# EAGLE schematic project (EAGLE 9.3.0)
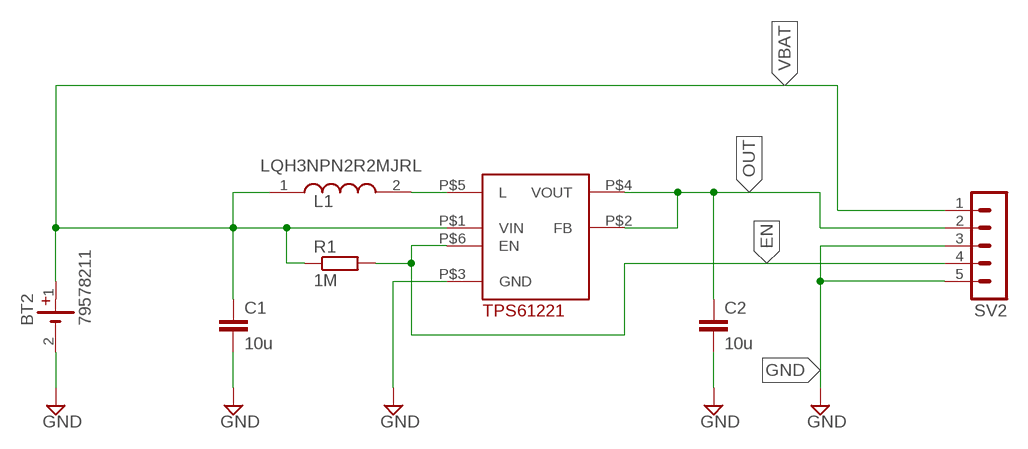
[diagram p0: schematic, sheet 1]

## Parts
BT2  79578211  [79578211]
C1  10u  C-EUC0805K  [C0805K]
C2  10u  C-EUC0805K  [C0805K]
L1  LQH3NPN2R2MJRL  [INDPM3030X120N]
R1  1M  R-EU_R0805  [R0805]
SV2  MA05-1  [MA05-1]
U$1  TPS61221  [TPS61221]

## Nets
EN: R1.2 SV2.4 U$1.P$6(EN)
GND: BT2.2(-) C1.2 C2.2 SV2.3 SV2.5 U$1.P$3(GND)
N$3: L1.2 U$1.P$5(L)
OUT: C2.1 SV2.2 U$1.P$2(FB) U$1.P$4(VOUT)
VBAT: BT2.1(+) C1.1 L1.1 R1.1 SV2.1 U$1.P$1(VIN)

## Library data of the parts
BT2 = Battery Holder:79578211: BATTERY HOLDER COIN PC PIN Manufacturer's datasheet <https://katalog.we-online.de/em/datasheet/79578211.pdf>; CREATED_BY: PCBLayout.com; DIGIKEY_PART_NO: 732-12330-ND; MANUFACTURER: Wurth Electronics Inc.; MPN: 79578211
C1 C2 = rcl:C-EU: CAPACITOR, European symbol; SPICEPREFIX: C
L1 = LQH3NPN2R2MJRL:LQH3NPN2R2MJRL: LQH3NPN_JR Series Inductor 2.2uH +/-20% 1212 (3030) Source: Datasheet <https://psearch.en.murata.com/inductor/product/LQH3NPN2R2MJR#.html>; DESCRIPTION: LQH3NPN_JR Series Inductor 2.2uH +/-20% 1212 (3030); HEIGHT: 1.2mm; MANUFACTURER_NAME: Murata Electronics; MANUFACTURER_PART_NUMBER: LQH3NPN2R2MJRL; MOUSER_PART_NUMBER: 81-LQH3NPN2R2MJRL; MOUSER_PRICE-STOCK: https://www.mouser.com/Search/Refine.aspx?Keyword=81-LQH3NPN2R2MJRL
R1 = rcl:R-EU_: RESISTOR, European symbol; SPICEPREFIX: R
SV2 = con-lstb:MA05-1: PIN HEADER; OC_FARNELL: unknown; OC_NEWARK: unknown
U$1 = TPS61221:TPS61221; AVAILABILITY: Unavailable; DESCRIPTION: the tps6122x family devices provide a power-supply solution for products powered by either a single-cell two-cell or ...; MF: Texas Instruments; MP: TPS61221; PACKAGE: SC-70 Texas Instruments; PRICE: None